# EasyEDA Pro project pdb-12-50.eprj

# Schematic base-board
Board Name: base-board; Create Date: 2025-12-14; Page Name: P1; Project Name: pdb-12-50; Schematic Name: base-board; Update Date: 2025-12-14; Company: EasyEDA.com; Page Size: A4; Version: V1.0
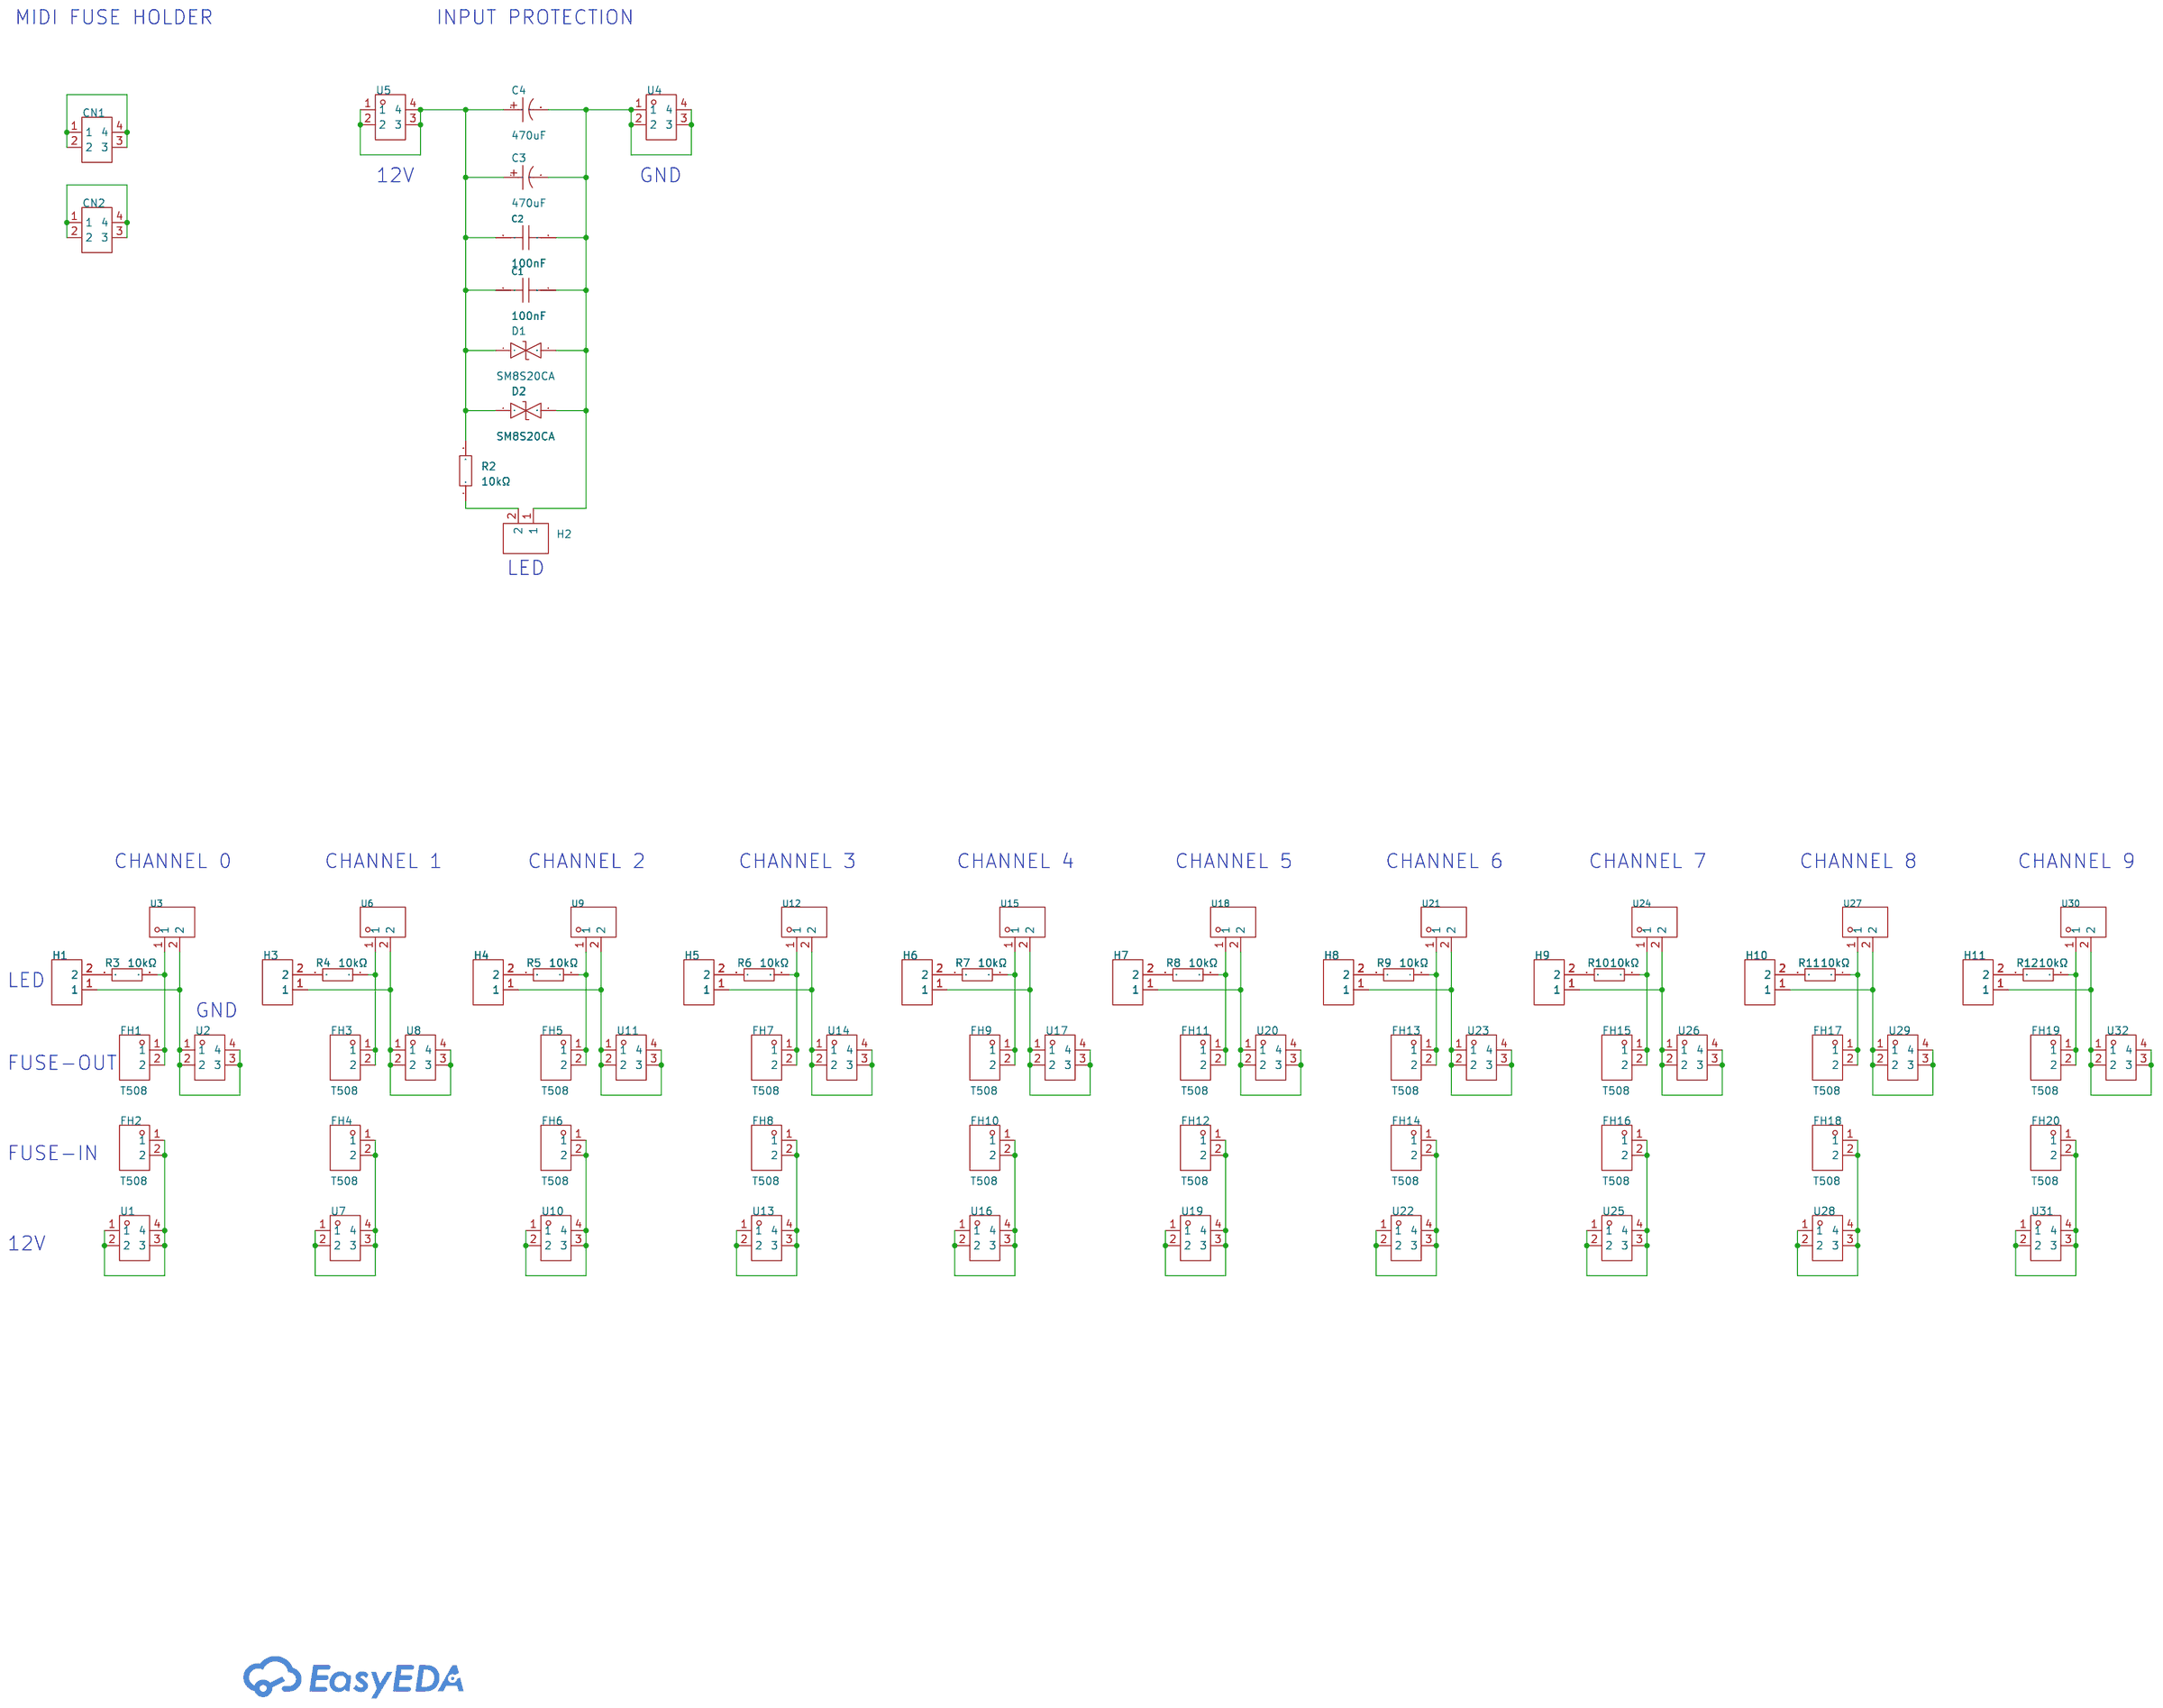
[diagram p0: schematic sheet]

## Parts
C1  100nF  [C1210]
C2  100nF  [C1210]
C3  470uF  [CAP-TH_BD10.0-P5.00-D1.0-FD]
C4  470uF  [CAP-TH_BD10.0-P5.00-D1.0-FD]
CN1  1007035CL5  [CONN-TH_4P-L10.5-W10.0_1007035CL5]
CN2  1007035CL5  [CONN-TH_4P-L10.5-W10.0_1007035CL5]
D1  SM8S20CA  [DO-218AB_L13.5-W8.4-LS15.5-BI]
D2  SM8S20CA  [DO-218AB_L13.5-W8.4-LS15.5-BI]
FH1  T508  [CONN-TH_T508]
FH2  T508  [CONN-TH_T508]
FH3  T508  [CONN-TH_T508]
FH4  T508  [CONN-TH_T508]
FH5  T508  [CONN-TH_T508]
FH6  T508  [CONN-TH_T508]
FH7  T508  [CONN-TH_T508]
FH8  T508  [CONN-TH_T508]
FH9  T508  [CONN-TH_T508]
FH10  T508  [CONN-TH_T508]
FH11  T508  [CONN-TH_T508]
FH12  T508  [CONN-TH_T508]
FH13  T508  [CONN-TH_T508]
FH14  T508  [CONN-TH_T508]
FH15  T508  [CONN-TH_T508]
FH16  T508  [CONN-TH_T508]
FH17  T508  [CONN-TH_T508]
FH18  T508  [CONN-TH_T508]
FH19  T508  [CONN-TH_T508]
FH20  T508  [CONN-TH_T508]
H1  PZ254V-11-02P  [HDR-TH_2P-P2.54-V-M]
H2  PZ254V-11-02P  [HDR-TH_2P-P2.54-V-M]
H3  PZ254V-11-02P  [HDR-TH_2P-P2.54-V-M]
H4  PZ254V-11-02P  [HDR-TH_2P-P2.54-V-M]
H5  PZ254V-11-02P  [HDR-TH_2P-P2.54-V-M]
H6  PZ254V-11-02P  [HDR-TH_2P-P2.54-V-M]
H7  PZ254V-11-02P  [HDR-TH_2P-P2.54-V-M]
H8  PZ254V-11-02P  [HDR-TH_2P-P2.54-V-M]
H9  PZ254V-11-02P  [HDR-TH_2P-P2.54-V-M]
H10  PZ254V-11-02P  [HDR-TH_2P-P2.54-V-M]
H11  PZ254V-11-02P  [HDR-TH_2P-P2.54-V-M]
R2  10kΩ  [R1206]
R3  10kΩ  [R1206]
R4  10kΩ  [R1206]
R5  10kΩ  [R1206]
R6  10kΩ  [R1206]
R7  10kΩ  [R1206]
R8  10kΩ  [R1206]
R9  10kΩ  [R1206]
R10  10kΩ  [R1206]
R11  10kΩ  [R1206]
R12  10kΩ  [R1206]
U1  66540S0M3  [SMD_66540S0M3]
U2  66540S0M3  [SMD_66540S0M3]
U3  KF635-6.35-2P  [CONN-TH_P6.35_KF635-6.35-2P]
U4  66540S0M3  [SMD_66540S0M3]
U5  66540S0M3  [SMD_66540S0M3]
U6  KF635-6.35-2P  [CONN-TH_P6.35_KF635-6.35-2P]
U7  66540S0M3  [SMD_66540S0M3]
U8  66540S0M3  [SMD_66540S0M3]
U9  KF635-6.35-2P  [CONN-TH_P6.35_KF635-6.35-2P]
U10  66540S0M3  [SMD_66540S0M3]
U11  66540S0M3  [SMD_66540S0M3]
U12  KF635-6.35-2P  [CONN-TH_P6.35_KF635-6.35-2P]
U13  66540S0M3  [SMD_66540S0M3]
U14  66540S0M3  [SMD_66540S0M3]
U15  KF635-6.35-2P  [CONN-TH_P6.35_KF635-6.35-2P]
U16  66540S0M3  [SMD_66540S0M3]
U17  66540S0M3  [SMD_66540S0M3]
U18  KF635-6.35-2P  [CONN-TH_P6.35_KF635-6.35-2P]
U19  66540S0M3  [SMD_66540S0M3]
U20  66540S0M3  [SMD_66540S0M3]
U21  KF635-6.35-2P  [CONN-TH_P6.35_KF635-6.35-2P]
U22  66540S0M3  [SMD_66540S0M3]
U23  66540S0M3  [SMD_66540S0M3]
U24  KF635-6.35-2P  [CONN-TH_P6.35_KF635-6.35-2P]
U25  66540S0M3  [SMD_66540S0M3]
U26  66540S0M3  [SMD_66540S0M3]
U27  KF635-6.35-2P  [CONN-TH_P6.35_KF635-6.35-2P]
U28  66540S0M3  [SMD_66540S0M3]
U29  66540S0M3  [SMD_66540S0M3]
U30  KF635-6.35-2P  [CONN-TH_P6.35_KF635-6.35-2P]
U31  66540S0M3  [SMD_66540S0M3]
U32  66540S0M3  [SMD_66540S0M3]

## Library data of the parts
C1 C2 = 1210B104K501CT: LCSC Part Name: 100nF ±10% 500V; Supplier Part: C304008; Manufacturer: Walsin(华新科); Supplier Footprint: 1210; JLCPCB Part Class: Extended Part; Datasheet: https://atta.szlcsc.com/upload/public/pdf/source/20181106/C328909_7C08FD405CB49CEB23FBF6F868428209.pdf; Supplier: LCSC; Tolerance: ±10%
C3 C4 = 50PX470MEFC10X20: LCSC Part Name: 470uF ±20% 50V; Supplier Part: C88733; Manufacturer: Rubycon(红宝石); Supplier Footprint: 插件,D10xL20mm; JLCPCB Part Class: Extended Part; Datasheet: https://item.szlcsc.com/datasheet/50PX470MEFC10X20/89913.html; Supplier: LCSC; Tolerance: ±20%; Voltage Rating: 50V; Pin Spacing: 5mm; Diameter: 10mm; Height - Seated (Max): 20mm; Lifetime: 2000hrs@105℃; Operating Temperature: -25℃~+105℃
CN1 CN2 = 1007035CL5: Supplier Part: C47121886; Manufacturer: SAMZO(三佐); Supplier Footprint: 插件; JLCPCB Part Class: Extended Part; Datasheet: https://item.szlcsc.com/datasheet/1007035CL5/49318034.html; Supplier: LCSC; Screw Hole Size: M5; Current Rating: 80A; Body Material: Brass; Ontology Coating: Tin; Operating Temperature: -25℃~+85℃; Terminal Type: Top
D1 D2 = SM8S20CA: LCSC Part Name: 双向TVS 20V截止 204A峰值脉冲; Supplier Part: C557519; Manufacturer: DOWO(东沃); Supplier Footprint: DO-218AB; JLCPCB Part Class: Extended Part; Datasheet: https://atta.szlcsc.com/upload/public/pdf/source/20200521/C557515_E6C167C5FE746524E8964280E01514FD.pdf; Supplier: LCSC; Reverse Stand-Off Voltage (Vrwm): 20V; Maximum Clamping Voltage: 32.4V; Peak Pulse Current (Ipp)@10/1000us: 204A; Breakdown Voltage: 22.2V; Reverse Leakage Current (Ir): 150uA; Type: TVS
FH1-FH20 = T508: LCSC Part Name: 三合一插片保险丝座; Supplier Part: C41355742; Manufacturer: XFCN(兴飞); Supplier Footprint: 插件; JLCPCB Part Class: Extended Part; Datasheet: https://atta.szlcsc.com/upload/public/pdf/source/20240815/411B016330D568D94D3F7EE5B5A5790B.pdf; Supplier: LCSC; Current Rating: 30A
H1-H11 = PZ254V-11-02P: Pin Structure:1x2P Pitch:2.54mm Row Spacing:- Circluar Pins/Square Pins:Pin Header Mounting Type:Through Hole Number of Rows:1 Number of Pins:2P Current Rating:- Voltage Rating (Max):- Length of Mating Pin:6mm Insulation Height:2.5mm Length of End Connect; LCSC Part Name: 1x2P 间距:2.54mm 方针 直插; Supplier Part: C492401; Manufacturer: XFCN(兴飞); Supplier Footprint: 插件,P=2.54mm; JLCPCB Part Class: Extended Part; Datasheet: https://item.szlcsc.com/datasheet/PZ254V-11-02P/502957.html; Supplier: LCSC; Pin Structure: 1x2P; Pitch: 2.54mm; Circluar Pins/Square Pins: Pin Header; Mounting Type: Through Hole; Number of Rows: 1; Number of Pins: 2P; Length of Mating Pin: 6mm; Insulation Height: 2.5mm; Length of End Connection Pin: 3mm; Contact Material: Brass; Operating Temperature: -40℃~+105℃; Color: Black
R2-R12 = 1206W4F1002T5E: Type:Thick Film Resistor Resistance:10kΩ Tolerance:±1% Tolerance:±1% Power(Watts):250mW Voltage-Supply(Max):200V Temperature Coefficient:±100ppm/℃ Temperature Coefficient:±100ppm/℃ Operating Temperature:-55℃~+155℃ Operating Temperature:-55℃~+155℃; LCSC Part Name: 10kΩ ±1% 250mW 厚膜电阻; Supplier Part: C17902; Manufacturer: UNI-ROYAL(厚声); Supplier Footprint: 1206; JLCPCB Part Class: Basic Part; Datasheet: https://item.szlcsc.com/datasheet/1206W4F1002T5E/18590.html; Supplier: LCSC; Type: Thick Film Resistor; Tolerance: ±1%; Power(Watts): 250mW; Voltage-Supply(Max): 200V; Temperature Coefficient: ±100ppm/℃; Operating Temperature: -55℃~+155℃
U1 U2 U4 U5 U7 U8 U10 U11 U13 U14 U16 U17 U19 U20 U22 U23 U25 U26 U28 U29 U31 U32 = 66540S0M3: LCSC Part Name: 两件套 PCB焊接端子四脚贴片6*6.5*4MM-拉伸M3螺丝 两件套; Supplier Part: C41416689; Manufacturer: SAMZO(三佐); Supplier Footprint: SMD-4P,10x6mm; JLCPCB Part Class: Extended Part; Datasheet: https://item.szlcsc.com/datasheet/66540S0M3/43240405.html; Supplier: LCSC
U3 U6 U9 U12 U15 U18 U21 U24 U27 U30 = KF635-6.35-2P: LCSC Part Name: 6.35mm 1x2P 排数:1 每排P数:2 直插; Supplier Part: C475102; Manufacturer: KEFA(科发); Supplier Footprint: 插件,P=6.35mm; JLCPCB Part Class: Extended Part; Datasheet: https://atta.szlcsc.com/upload/public/pdf/source/20230317/51AC42F2E205921DAA0F567C0F76713A.pdf; Supplier: LCSC; Structure: 1x2P; Pitch: 6.35mm; Color: Green; Mounting Style: Straight; Current Rating (Max): 32A; Voltage Rating (Max): 450V; Number of Pins: 2P; Number of Rows: 1; Wire Gauge - AWG: 10~22; Wire Gauge - mm2: 4; Number of PINs Per Row: 2; Operating Temperature Range: -40℃~+105℃

## Nets
$1N300: FH2.1 FH2.2 U1.1 U1.2 U1.3 U1.4
$1N355: H1.1 U2.1 U2.2 U2.3 U2.4 U3.2
$1N955: FH1.1 FH1.2 R3.1 U3.1
$1N1267: H2.2 R2.1
$1N1395: C1.1 C2.1 C3.2 C4.2 D1.2 D2.2 H2.1 U4.1 U4.2 U4.3 U4.4
$1N1410: C1.2 C2.2 C3.1 C4.1 D1.1 D2.1 R2.2 U5.1 U5.2 U5.3 U5.4
$1N1606: H1.2 R3.2
$1N1829: CN1.1 CN1.2 CN1.3 CN1.4
$1N1881: CN2.1 CN2.2 CN2.3 CN2.4
$1N2210: FH4.1 FH4.2 U7.1 U7.2 U7.3 U7.4
$1N2218: H3.1 U6.2 U8.1 U8.2 U8.3 U8.4
$1N2227: FH3.1 FH3.2 R4.1 U6.1
$1N2232: H3.2 R4.2
$1N2485: FH5.1 FH5.2 R5.1 U9.1
$1N2490: H4.1 U9.2 U11.1 U11.2 U11.3 U11.4
$1N2499: FH6.1 FH6.2 U10.1 U10.2 U10.3 U10.4
$1N2507: H4.2 R5.2
$1N2760: FH7.1 FH7.2 R6.1 U12.1
$1N2765: H5.1 U12.2 U14.1 U14.2 U14.3 U14.4
$1N2774: FH8.1 FH8.2 U13.1 U13.2 U13.3 U13.4
$1N2782: H5.2 R6.2
$1N3035: FH9.1 FH9.2 R7.1 U15.1
$1N3040: H6.1 U15.2 U17.1 U17.2 U17.3 U17.4
$1N3049: FH10.1 FH10.2 U16.1 U16.2 U16.3 U16.4
$1N3057: H6.2 R7.2
$1N4319: H10.2 R11.2
$1N4321: H9.1 U24.2 U26.1 U26.2 U26.3 U26.4
$1N4330: FH15.1 FH15.2 R10.1 U24.1
$1N4335: FH16.1 FH16.2 U25.1 U25.2 U25.3 U25.4
$1N4343: H11.1 U30.2 U32.1 U32.2 U32.3 U32.4
$1N4352: FH19.1 FH19.2 R12.1 U30.1
$1N4357: H11.2 R12.2
$1N4359: H10.1 U27.2 U29.1 U29.2 U29.3 U29.4
$1N4368: FH17.1 FH17.2 R11.1 U27.1
$1N4373: FH20.1 FH20.2 U31.1 U31.2 U31.3 U31.4
$1N4381: FH18.1 FH18.2 U28.1 U28.2 U28.3 U28.4
$1N4389: H9.2 R10.2
$1N4391: H7.1 U18.2 U20.1 U20.2 U20.3 U20.4
$1N4400: FH14.1 FH14.2 U22.1 U22.2 U22.3 U22.4
$1N4408: FH12.1 FH12.2 U19.1 U19.2 U19.3 U19.4
$1N4416: FH11.1 FH11.2 R8.1 U18.1
$1N4421: H8.1 U21.2 U23.1 U23.2 U23.3 U23.4
$1N4430: FH13.1 FH13.2 R9.1 U21.1
$1N4435: H8.2 R9.2
$1N4437: H7.2 R8.2

## Notes on the sheet
- MIDI FUSE HOLDER
- INPUT PROTECTION
- 12V
- GND
- LED
- CHANNEL 0
- CHANNEL 1
- CHANNEL 2
- CHANNEL 3
- CHANNEL 4
- CHANNEL 5
- CHANNEL 6
- CHANNEL 7
- CHANNEL 8
- CHANNEL 9
- LED
- GND
- FUSE-OUT
- FUSE-IN
- 12V

# Board base-board
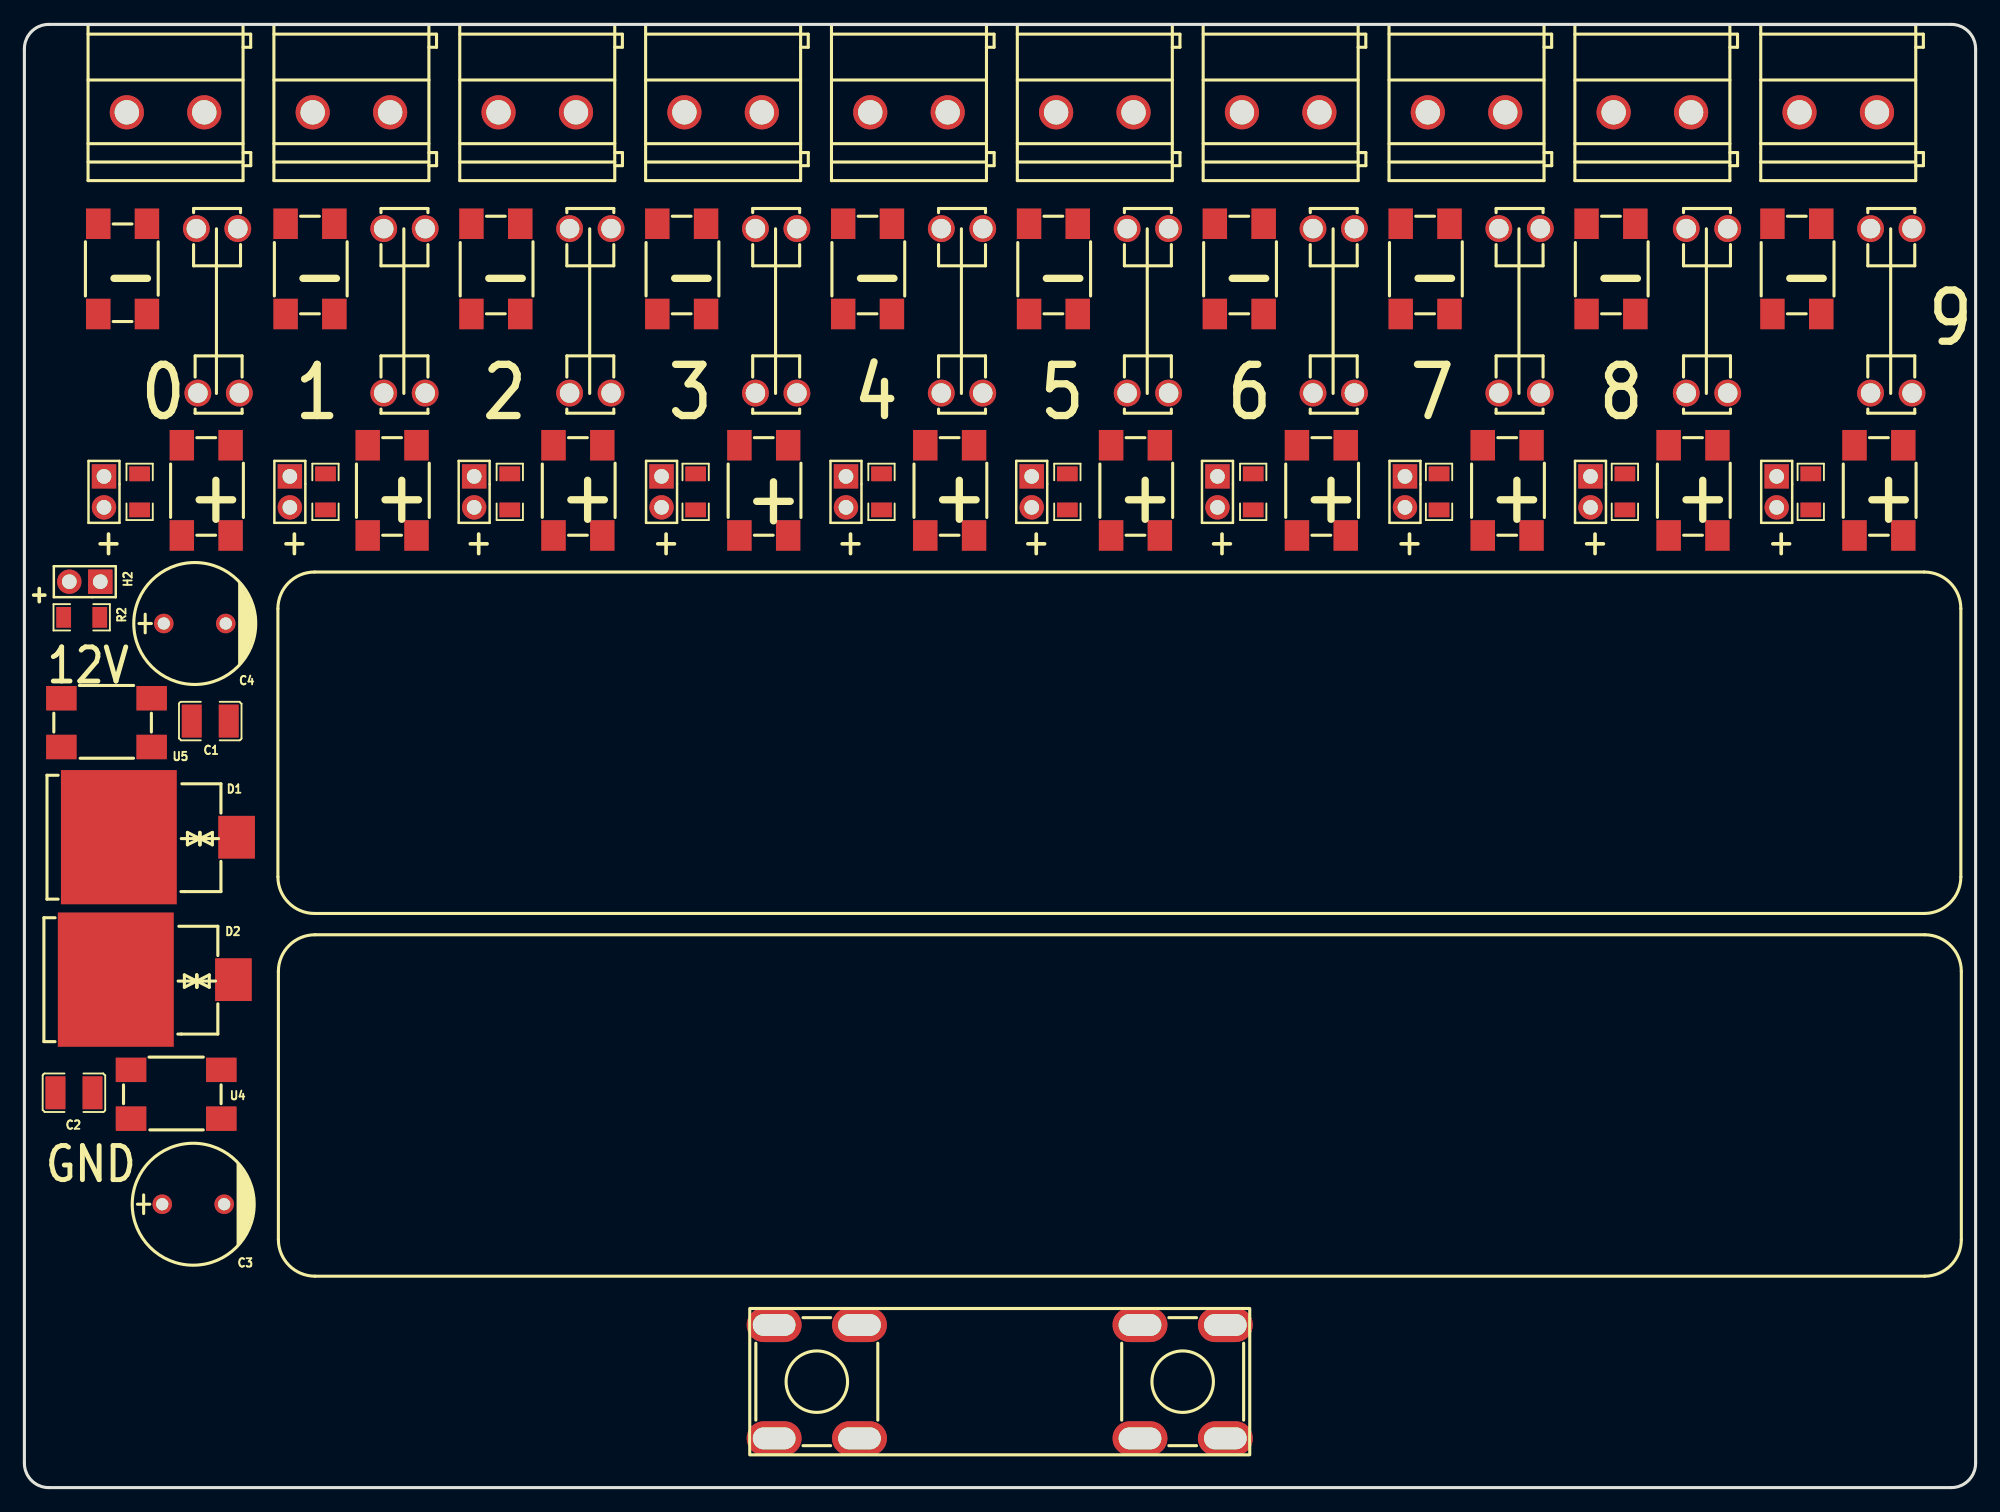
[diagram p1: board, top side]
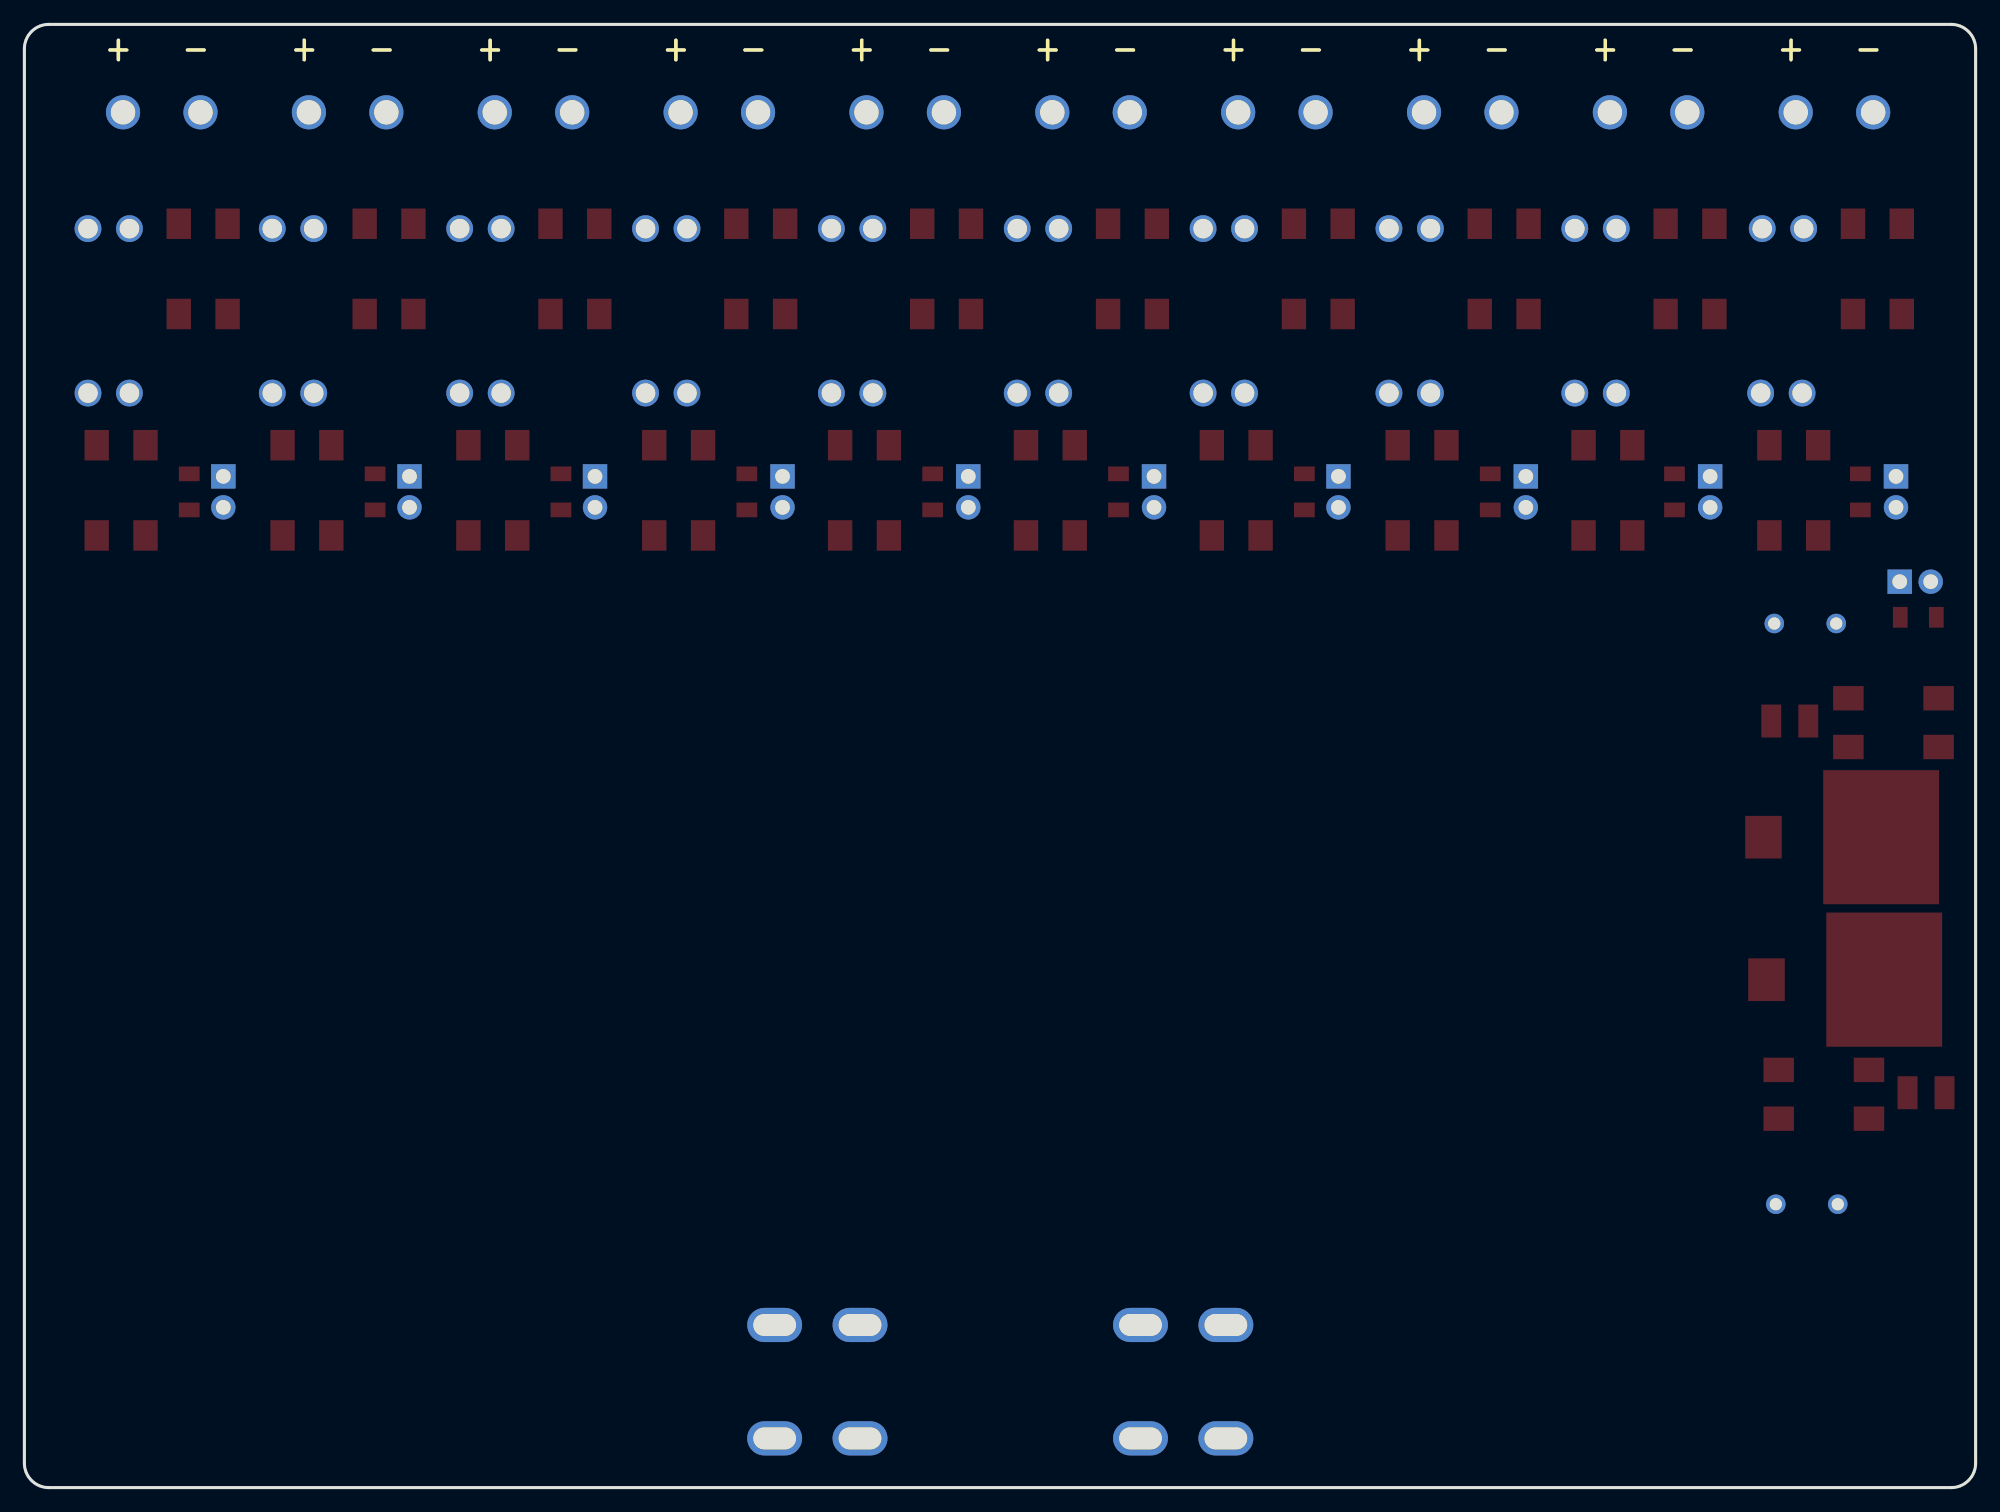
[diagram p2: board, bottom side, seen from below]

Outline 160 x 120 mm; copper layers: Top Layer, Bottom Layer. Coordinates in mm from the lower left corner of the outline.
Outline path: 0,118 0,2 arc(0.59,0.59) 2,0 158,0 arc(159.41,0.59) 160,2 160,118 arc(159.41,119.41) 158,120 2,120 arc(0.59,119.41) 0,118
Stack: Top Layer 0.035mm / Dielectric1 1.51mm FR4 er 4.5 / Bottom Layer 0.035mm

## Design rules (mm)
template: JLCPCB Capability(Two Layers Board)
spacing copperThickness1oz (default): track to track 0.102, other pairs 0.152 to 0.3
spacing copperThickness2oz: track to track 0.203, other pairs 0.152 to 0.3
track width copperThickness1oz (default): min 0.127, default 0.254, max 2.54
track width copperThickness2oz: min 0.203, default 0.254, max 2.54
differential pair differentialPair (default): width min 0.127, default 0.254, max 2.54; gap min 0.152, default 0.152
via viaSize (default): diameter min 0.5, default 0.61, max 10; hole min 0.3, default 0.305, max 6.3

## Placement (name value [footprint] x y rotation side)
C1  100nF  [C1210]  15.24 62.86 180 top
C2  100nF  [C1210]  4.06 32.38 180 top
C3  470uF  [CAP-TH_BD10.0-P5.00-D1.0-FD]  13.84 23.24 0 top
C4  470uF  [CAP-TH_BD10.0-P5.00-D1.0-FD]  13.97 70.87 0 top
CN1  1007035CL5  [CONN-TH_4P-L10.5-W10.0_1007035CL5]  64.98 8.69 90 top
CN2  1007035CL5  [CONN-TH_4P-L10.5-W10.0_1007035CL5]  94.98 8.69 90 top
D1  SM8S20CA  [DO-218AB_L13.5-W8.4-LS15.5-BI]  12.57 53.34 0 top
D2  SM8S20CA  [DO-218AB_L13.5-W8.4-LS15.5-BI]  12.32 41.66 0 top
FH1  T508  [CONN-TH_T508]  15.8 103.25 180 top
FH2  T508  [CONN-TH_T508]  15.93 89.76 0 top
FH3  T508  [CONN-TH_T508]  31.17 103.25 180 top
FH4  T508  [CONN-TH_T508]  31.17 89.76 0 top
FH5  T508  [CONN-TH_T508]  46.41 103.25 180 top
FH6  T508  [CONN-TH_T508]  46.41 89.76 0 top
FH7  T508  [CONN-TH_T508]  61.65 103.25 180 top
FH8  T508  [CONN-TH_T508]  61.65 89.76 0 top
FH9  T508  [CONN-TH_T508]  76.89 103.25 180 top
FH10  T508  [CONN-TH_T508]  76.89 89.76 0 top
FH11  T508  [CONN-TH_T508]  92.13 103.25 180 top
FH12  T508  [CONN-TH_T508]  92.13 89.76 0 top
FH13  T508  [CONN-TH_T508]  107.37 103.25 180 top
FH14  T508  [CONN-TH_T508]  107.37 89.76 0 top
FH15  T508  [CONN-TH_T508]  122.61 103.25 180 top
FH16  T508  [CONN-TH_T508]  122.61 89.76 0 top
FH17  T508  [CONN-TH_T508]  137.97 103.25 180 top
FH18  T508  [CONN-TH_T508]  137.97 89.76 0 top
FH19  T508  [CONN-TH_T508]  153.09 103.25 180 top
FH20  T508  [CONN-TH_T508]  153.09 89.76 0 top
H1  PZ254V-11-02P  [HDR-TH_2P-P2.54-V-M]  6.53 81.66 270 top
H2  PZ254V-11-02P  [HDR-TH_2P-P2.54-V-M]  4.95 74.3 180 top
H3  PZ254V-11-02P  [HDR-TH_2P-P2.54-V-M]  21.77 81.66 270 top
H4  PZ254V-11-02P  [HDR-TH_2P-P2.54-V-M]  36.88 81.66 270 top
H5  PZ254V-11-02P  [HDR-TH_2P-P2.54-V-M]  52.25 81.66 270 top
H6  PZ254V-11-02P  [HDR-TH_2P-P2.54-V-M]  67.37 81.66 270 top
H7  PZ254V-11-02P  [HDR-TH_2P-P2.54-V-M]  82.6 81.66 270 top
H8  PZ254V-11-02P  [HDR-TH_2P-P2.54-V-M]  97.83 81.66 270 top
H9  PZ254V-11-02P  [HDR-TH_2P-P2.54-V-M]  113.21 81.66 270 top
H10  PZ254V-11-02P  [HDR-TH_2P-P2.54-V-M]  128.42 81.66 270 top
H11  PZ254V-11-02P  [HDR-TH_2P-P2.54-V-M]  143.69 81.66 270 top
R2  10kΩ  [R1206]  4.7 71.37 0 top
R3  10kΩ  [R1206]  9.45 81.66 270 top
R4  10kΩ  [R1206]  24.69 81.66 270 top
R5  10kΩ  [R1206]  39.8 81.66 270 top
R6  10kΩ  [R1206]  55.04 81.66 270 top
R7  10kΩ  [R1206]  70.28 81.66 270 top
R8  10kΩ  [R1206]  85.52 81.66 270 top
R9  10kΩ  [R1206]  100.76 81.66 270 top
R10  10kΩ  [R1206]  116 81.66 270 top
R11  10kΩ  [R1206]  131.24 81.66 270 top
R12  10kΩ  [R1206]  146.48 81.66 270 top
U1  66540S0M3  [SMD_66540S0M3]  14.91 81.79 90 top
U2  66540S0M3  [SMD_66540S0M3]  8.05 99.95 270 top
U3  KF635-6.35-2P  [CONN-TH_P6.35_KF635-6.35-2P]  11.58 112.79 180 top
U4  66540S0M3  [SMD_66540S0M3]  12.45 32.26 180 top
U5  66540S0M3  [SMD_66540S0M3]  6.73 62.74 180 top
U6  KF635-6.35-2P  [CONN-TH_P6.35_KF635-6.35-2P]  26.82 112.79 180 top
U7  66540S0M3  [SMD_66540S0M3]  30.15 81.79 90 top
U8  66540S0M3  [SMD_66540S0M3]  23.42 99.95 90 top
U9  KF635-6.35-2P  [CONN-TH_P6.35_KF635-6.35-2P]  42.06 112.79 180 top
U10  66540S0M3  [SMD_66540S0M3]  45.39 81.79 90 top
U11  66540S0M3  [SMD_66540S0M3]  38.66 99.95 90 top
U12  KF635-6.35-2P  [CONN-TH_P6.35_KF635-6.35-2P]  57.3 112.79 180 top
U13  66540S0M3  [SMD_66540S0M3]  60.63 81.79 90 top
U14  66540S0M3  [SMD_66540S0M3]  53.9 99.95 90 top
U15  KF635-6.35-2P  [CONN-TH_P6.35_KF635-6.35-2P]  72.54 112.79 180 top
U16  66540S0M3  [SMD_66540S0M3]  75.87 81.79 90 top
U17  66540S0M3  [SMD_66540S0M3]  69.14 99.95 90 top
U18  KF635-6.35-2P  [CONN-TH_P6.35_KF635-6.35-2P]  87.78 112.79 180 top
U19  66540S0M3  [SMD_66540S0M3]  91.11 81.79 90 top
U20  66540S0M3  [SMD_66540S0M3]  84.38 99.95 90 top
U21  KF635-6.35-2P  [CONN-TH_P6.35_KF635-6.35-2P]  103.02 112.79 180 top
U22  66540S0M3  [SMD_66540S0M3]  106.35 81.79 90 top
U23  66540S0M3  [SMD_66540S0M3]  99.62 99.95 90 top
U24  KF635-6.35-2P  [CONN-TH_P6.35_KF635-6.35-2P]  118.26 112.79 180 top
U25  66540S0M3  [SMD_66540S0M3]  121.59 81.79 90 top
U26  66540S0M3  [SMD_66540S0M3]  114.86 99.95 90 top
U27  KF635-6.35-2P  [CONN-TH_P6.35_KF635-6.35-2P]  133.5 112.79 180 top
U28  66540S0M3  [SMD_66540S0M3]  136.83 81.79 90 top
U29  66540S0M3  [SMD_66540S0M3]  130.1 99.95 90 top
U30  KF635-6.35-2P  [CONN-TH_P6.35_KF635-6.35-2P]  148.74 112.79 180 top
U31  66540S0M3  [SMD_66540S0M3]  152.07 81.79 90 top
U32  66540S0M3  [SMD_66540S0M3]  145.34 99.95 90 top

## Footprints (pads in the part's own frame, mm; a bottom-side part is the same pattern mirrored in y, then rotated)
C1210
  rect 1.635x2.7 smd: 1(-1.518,0) 2(1.518,0)
CAP-TH_BD10.0-P5.00-D1.0-FD
  round 1.6 hole 1: 1(-2.54,0) 2(2.54,0)
CONN-TH_4P-L10.5-W10.0_1007035CL5
  oval 2.8x4.5 hole 1.8x3.5: 1(-4.65,3.5) 2(-4.65,-3.5) 3(4.65,-3.5) 4(4.65,3.5)
CONN-TH_P6.35_KF635-6.35-2P
  round 2.8 hole 2: 1(-3.175,0) 2(3.175,0)
CONN-TH_T508
  round 2.2 hole 1.6: 1(1.7,0) 2(-1.7,0)
DO-218AB_L13.5-W8.4-LS15.5-BI
  rect 9.5x11 smd: 1(-4.825,0)
  rect 3x3.5 smd: 2(4.825,0)
HDR-TH_2P-P2.54-V-M
  rect 2x2 hole 1.2: 1(-1.27,0)
  round 2 hole 1.2: 2(1.27,0)
R1206
  rect 1.208x1.701 smd: 1(-1.479,0) 2(1.479,0)
SMD_66540S0M3
  rect 2.5x2 smd: 1(-3.7,2) 2(3.7,2) 3(-3.7,-2) 4(3.7,-2)

## Nets
As in the schematic.

## Text on the board
Bottom Silkscreen Layer: - | +
Top Silkscreen Layer: + | GND | 12V | - | 0 | 1 | 2 | 3 | 4 | 5 | 6 | 7 | 8 | 9
